# EAGLE design vogelschuss-2 (EAGLE 4.15)
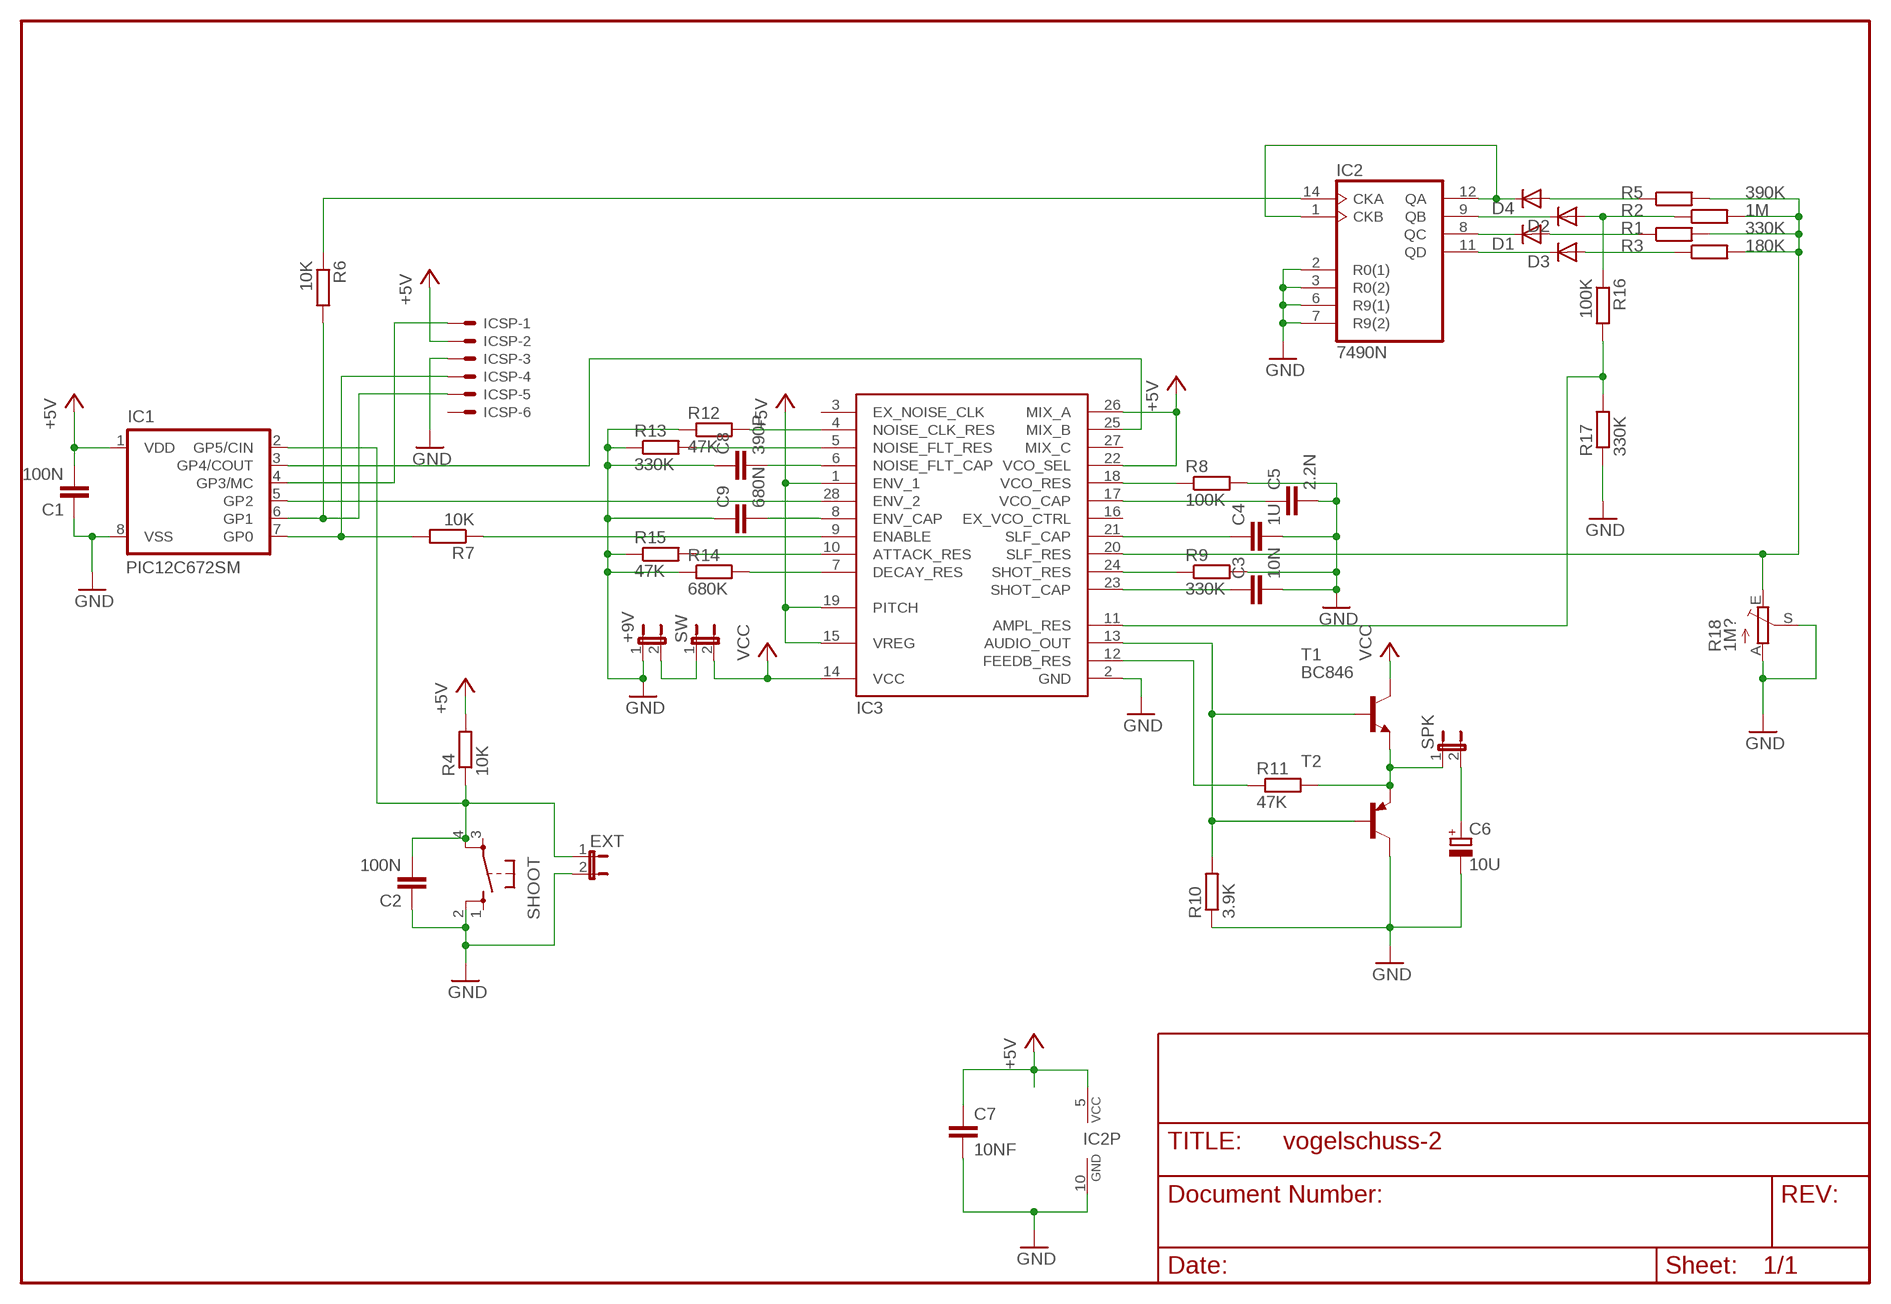
[diagram p0: schematic, sheet 1]

## Parts
+9V  JP1E  [JP1]
C1  100N  C-EUC0805  [C0805]
C2  100N  C-EUC0805  [C0805]
C3  10N  C-EUC0805  [C0805]
C4  1U  C-EUC0805  [C0805]
C5  2.2N  C-EUC0805  [C0805]
C6  10U  CPOL-EUE2,5-6E  [E2,5-6E]
C7  10NF  C-EUC0805  [C0805]
C8  390P  C-EUC0805  [C0805]
C9  680N  C-EUC0805  [C0805]
D1  DIODE-0805  [0805]
D2  DIODE-0805  [0805]
D3  DIODE-0805  [0805]
D4  DIODE-0805  [0805]
EXT  JP1E  [JP1]
IC1  PIC12C672SM  [SO-08M]
IC2  7490N  [DIL14]
IC3  SN76477  [DIL28-6]
ICSP  53047-06  [53047-06]
R1  330K  R-EU_M0805  [M0805]
R2  1M  R-EU_M0805  [M0805]
R3  180K  R-EU_M0805  [M0805]
R4  10K  R-EU_M0805  [M0805]
R5  390K  R-EU_M0805  [M0805]
R6  10K  R-EU_M0805  [M0805]
R7  10K  R-EU_M0805  [M0805]
R8  100K  R-EU_M0805  [M0805]
R9  330K  R-EU_M0805  [M0805]
R10  3.9K  R-EU_M0805  [M0805]
R11  47K  R-EU_M0805  [M0805]
R12  47K  R-EU_R0805  [R0805]
R13  330K  R-EU_M0805  [M0805]
R14  680K  R-EU_M0805  [M0805]
R15  47K  R-EU_R0805  [R0805]
R16  100K  R-EU_M0805  [M0805]
R17  330K  R-EU_M0805  [M0805]
R18  1M?  TRIM_EU-CA6V  [CA6V]
SHOOT  10XX  [B3F-10XX]
SPK  JP1E  [JP1]
SW  JP1E  [JP1]
T1  BC846  [SOT23]
T2  BC856A-PNP-SOT23-BEC  [SOT23-BEC]

## Nets
+5V: C1.2 C7.1 IC1.1(VDD) IC2.5(VCC) IC3.1(ENV_1) IC3.15(VREG) IC3.19(PITCH) IC3.22(VCO_SEL) IC3.26(MIX_A) ICSP.2 R4.2
GND: +9V.1 C1.1 C2.1 C3.2 C4.2 C5.2 C6.- C7.2 C8.1 C9.1 EXT.2 IC1.8(VSS) IC2.2(R0(1)) IC2.3(R0(2)) IC2.6(R9(1)) IC2.7(R9(2)) IC2.10(GND) IC3.2(GND) ICSP.3 R8.2 R9.2 R10.1 R12.1 R13.1 R14.1 R15.1 R17.1 R18.A R18.S SHOOT.2 T2.C
N$1: C6.+ SPK.2
N$2: C2.2 EXT.1 IC1.2(GP5/CIN) R4.1 SHOOT.4
N$3: IC1.6(GP1) ICSP.5 R6.2
N$4: IC2.14(CKA) R6.1
N$5: D4.2(C) IC2.1(CKB) IC2.12(QA)
N$6: D2.2(C) IC2.9(QB)
N$7: D1.2(C) IC2.8(QC)
N$8: D3.2(C) IC2.11(QD)
N$9: D2.1(A) R2.1 R16.1
N$10: D4.1(A) R5.1
N$11: D1.1(A) R1.1
N$12: D3.1(A) R3.1
N$13: IC3.20(SLF_RES) R1.2 R2.2 R3.2 R5.2 R18.E
N$14: IC3.4(NOISE_CLK_RES) R12.2
N$15: R11.2 SPK.1 T1.2(E) T2.E
N$16: IC3.18(VCO_RES) R8.1
N$17: IC3.13(AUDIO_OUT) R10.2 T1.1(B) T2.B
N$18: IC3.12(FEEDB_RES) R11.1
N$19: IC3.11(AMPL_RES) R16.2 R17.2
N$20: C5.1 IC3.17(VCO_CAP)
N$21: C4.1 IC3.21(SLF_CAP)
N$22: IC3.5(NOISE_FLT_RES) R13.2
N$23: IC3.24(SHOT_RES) R9.1
N$24: C3.1 IC3.23(SHOT_CAP)
N$25: IC3.10(ATTACK_RES) R15.2
N$26: IC3.7(DECAY_RES) R14.2
N$27: IC1.7(GP0) ICSP.4 R7.2
N$28: C8.2 IC3.6(NOISE_FLT_CAP)
N$29: C9.2 IC3.8(ENV_CAP)
N$30: IC1.3(GP4/COUT) IC3.25(MIX_B)
N$31: IC1.5(GP2) IC3.28(ENV_2)
N$32: IC3.9(ENABLE) R7.1
N$33: IC1.4(GP3/MC) ICSP.1
N$34: +9V.2 SW.1
VCC: IC3.14(VCC) SW.2 T1.3(C)
Unconnected: IC3.3(EX_NOISE_CLK) IC3.16(EX_VCO_CTRL) IC3.27(MIX_C) ICSP.6 SHOOT.1 SHOOT.3

## Library data of the parts
+9V EXT SPK SW = jumper:JP1E: JUMPER
C1-C5 C7-C9 = rcl:C-EU: CAPACITOR, European symbol
C6 = rcl:CPOL-EU: POLARIZED CAPACITOR, European symbol
D1-D4 = diode:DIODE-: DIODE
IC1 = microchip:PIC12C*?: MICROCONTROLLER
IC2 = 74xx-eu:74*90: Decade, divide by twelve and binary COUNTER
IC3 = turbod3:SN76477
ICSP = con-molex:53?-06: CONNECTOR wire to board 1.25 mm (.049 inch) pitch header
R1-R17 = rcl:R-EU_: RESISTOR, European symbol
R18 = pot:TRIM_EU-: POTENTIOMETER
SHOOT = KEY_B:10XX
T1 = transistor:BC846: NPN TRANSISTOR
T2 = transistor:*-PNP-: PNP Transistror

## Net classes
0 default: width 0.3 mm

## Board
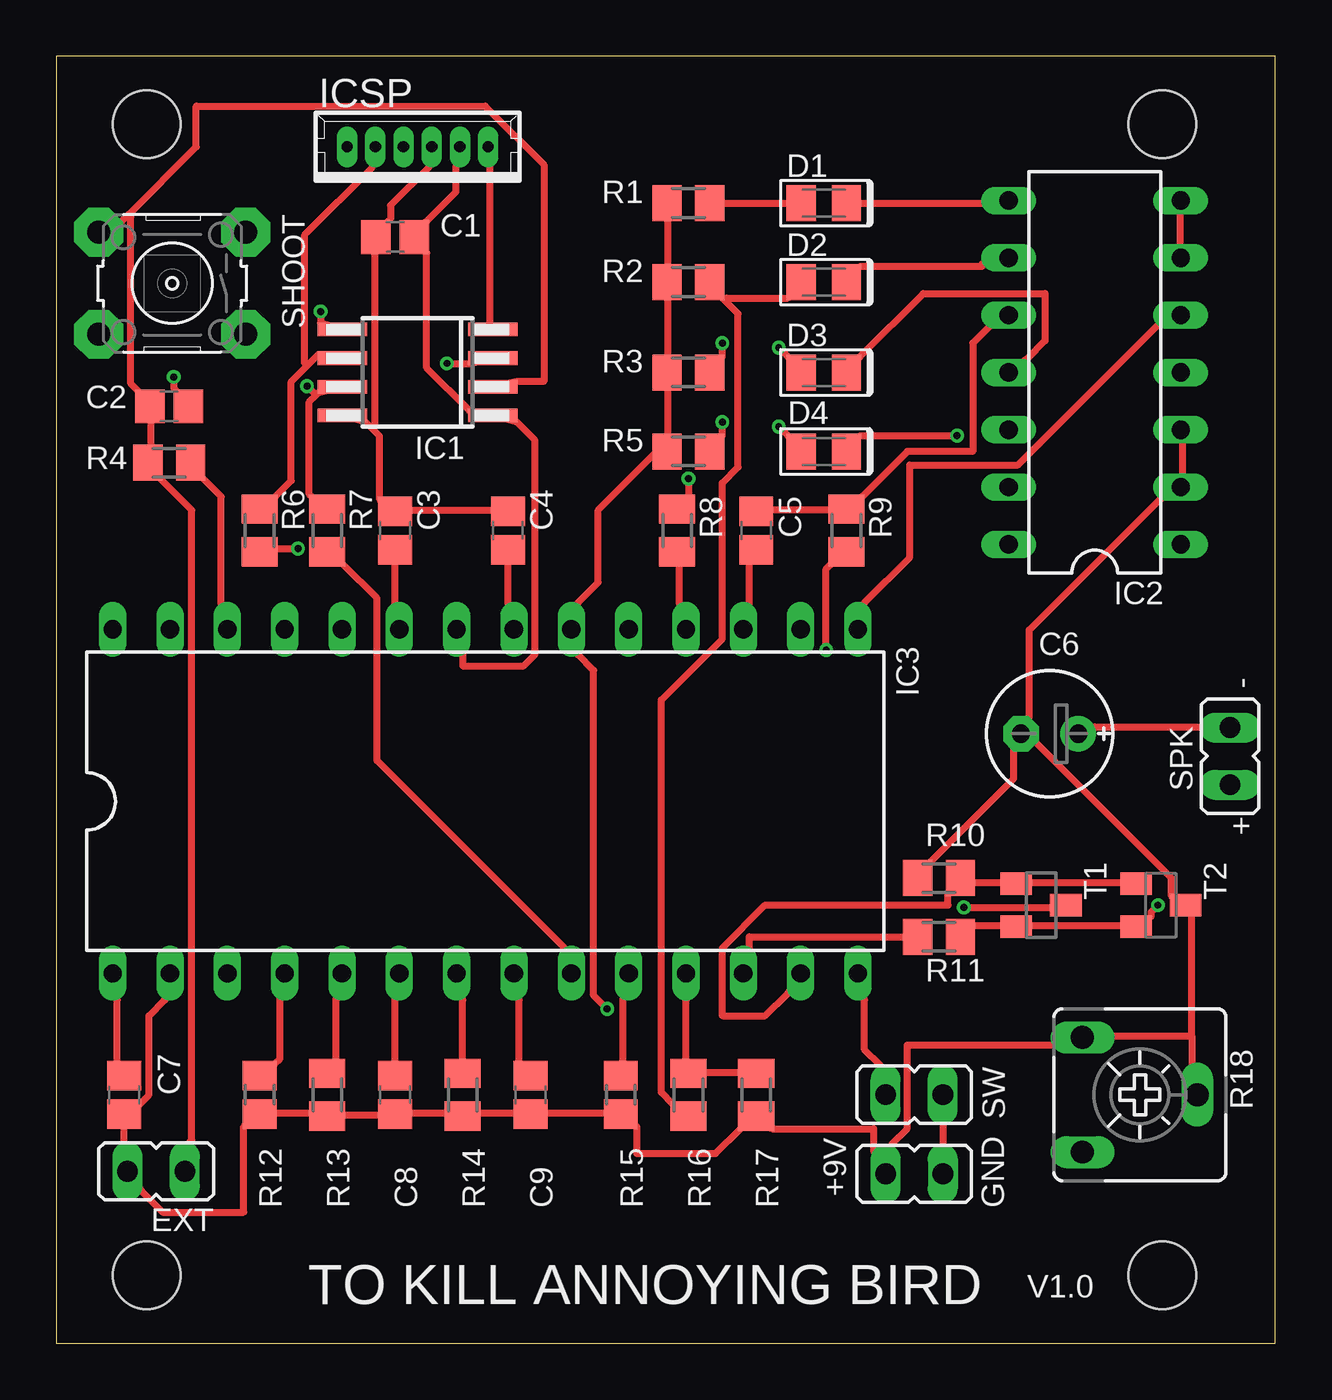
[diagram p1: board, top side]
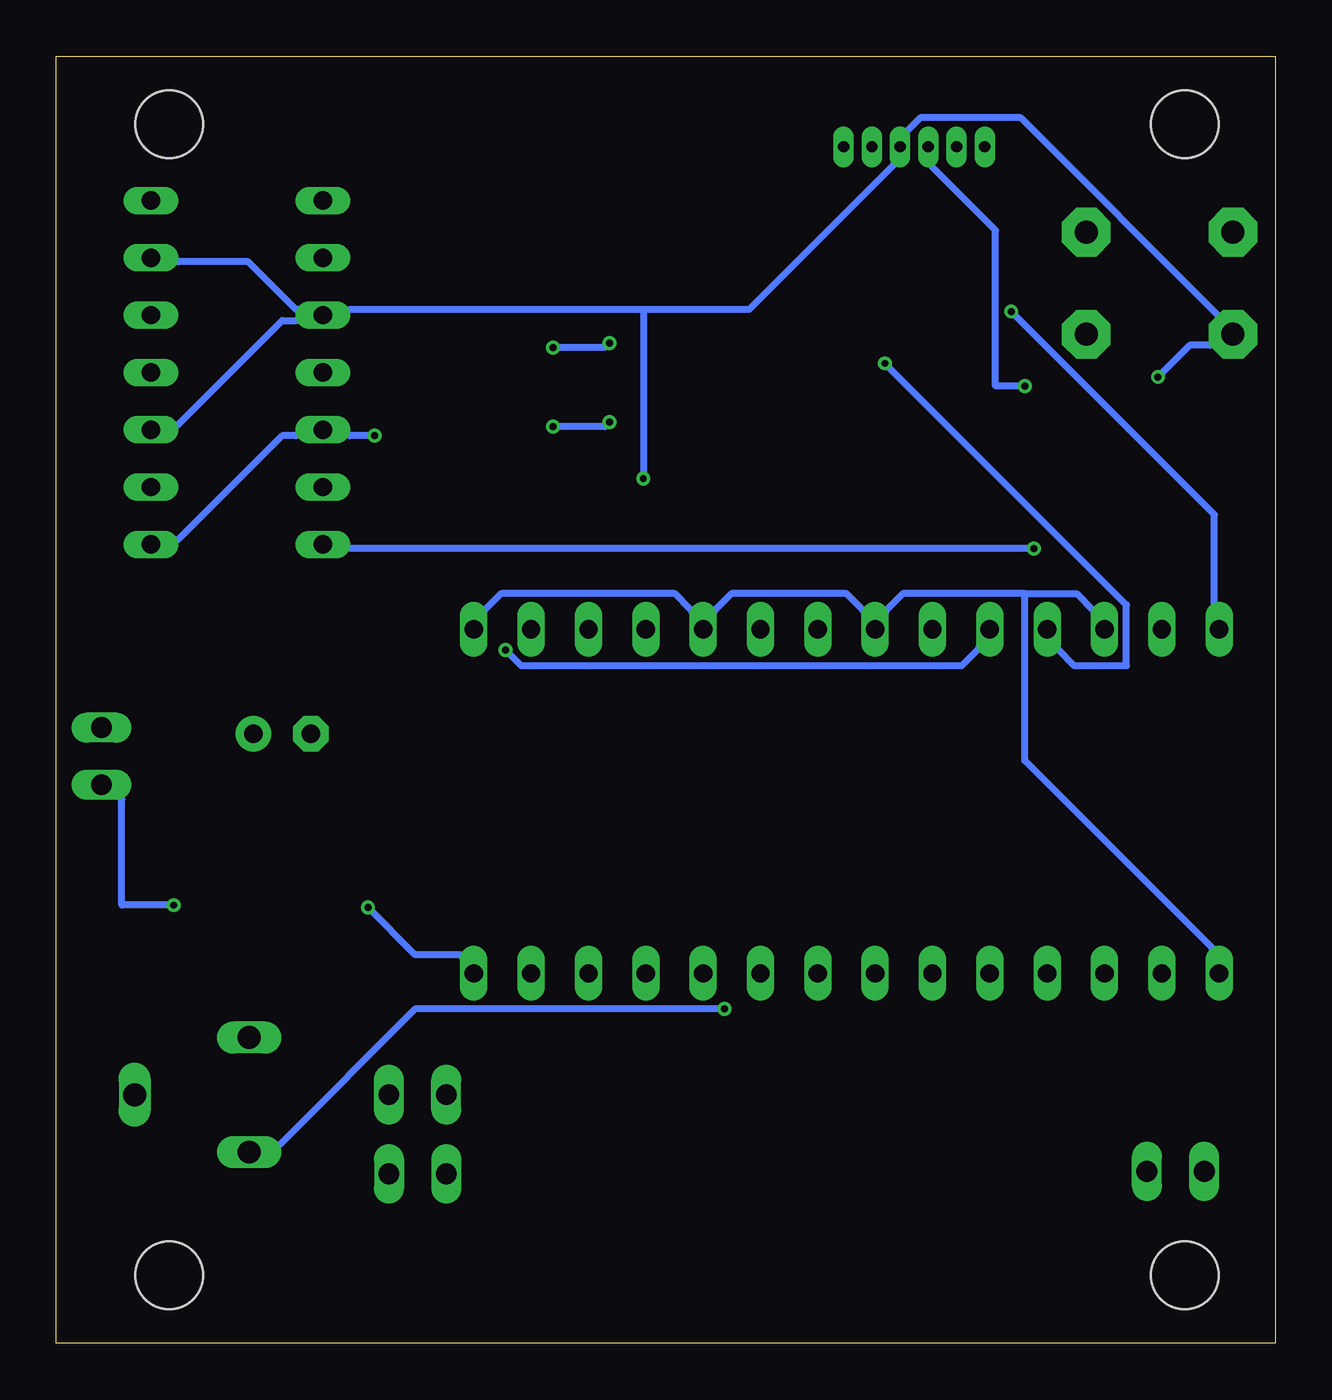
[diagram p2: board, bottom side, seen from below]

Size 54 x 57 mm. Coordinates in mm from the lower left corner, seen from the top.
Outline: 0,0 54,0 54,57 0,57 0,0
Copper layers (1*16): Top 0.035mm / dielectric 1.5mm / Bottom 0.035mm
Design rules "PCB-POOL": minimum track width 6mil, minimum drill 12mil, track to track 6mil, track to pad 6mil, pad to pad 6mil, via to via 6mil, smd to smd 6mil, copper to edge 20mil, drill to drill 8mil, minimum pad ring 8mil, minimum via ring 6mil, stop-mask expansion 3mil, vias tented up to drill 0mil, thermal gap 8mil
Holes 3 mm at 4,54 49,54 4,3 49,3

### Footprints (pad centres in the part's own frame; a part is rotated, then mirrored left to right if it is on the bottom)
JP1 = drill 0.914 long: 1 0,-1.27; 2 0,1.27
C0805 = smd 1.3 x 1.5: 1 -0.85,0; 2 0.85,0
E2,5-6E = drill 0.813 pad 1.575 round: + -1.27,0 | drill 0.813 pad 1.575 octagon: - 1.27,0
0805 = smd 1.3 x 1.6: 1 -1,0; 2 1,0
SO-08M = smd 0.6 x 2.2: 1 -1.905,-3.33; 2 -0.635,-3.33; 3 0.635,-3.33; 4 1.905,-3.33; 5 1.905,3.33; 6 0.635,3.33; 7 -0.635,3.33; 8 -1.905,3.33
DIL14 = drill 0.813 long: 1 -7.62,-3.81; 2 -5.08,-3.81; 3 -2.54,-3.81; 4 0,-3.81; 5 2.54,-3.81; 6 5.08,-3.81; 7 7.62,-3.81; 8 7.62,3.81; 9 5.08,3.81; 10 2.54,3.81; 11 0,3.81; 12 -2.54,3.81; 13 -5.08,3.81; 14 -7.62,3.81
DIL28-6 = drill 0.813 long: 1 -16.51,-7.62; 2 -13.97,-7.62; 3 -11.43,-7.62; 4 -8.89,-7.62; 5 -6.35,-7.62; 6 -3.81,-7.62; 7 -1.27,-7.62; 8 1.27,-7.62; 9 3.81,-7.62; 10 6.35,-7.62; 11 8.89,-7.62; 12 11.43,-7.62; 13 13.97,-7.62; 14 16.51,-7.62; 15 16.51,7.62; 16 13.97,7.62; 17 11.43,7.62; 18 8.89,7.62; 19 6.35,7.62; 20 3.81,7.62; 21 1.27,7.62; 22 -1.27,7.62; 23 -3.81,7.62; 24 -6.35,7.62; 25 -8.89,7.62; 26 -11.43,7.62; 27 -13.97,7.62; 28 -16.51,7.62
53047-06 = drill 0.5 pad 0.698 long: 1 3.125,0; 2 1.875,0; 3 0.625,0; 4 -0.625,0; 5 -1.875,0; 6 -3.125,0
M0805 = smd 1.3 x 1.6: 1 -0.95,0; 2 0.95,0
R0805 = smd 1.3 x 1.5: 1 -0.85,0; 2 0.85,0
CA6V = drill 1.016 long: A -2.54,-2.54; E 2.54,-2.54; S 0,2.54
B3F-10XX = drill 1.016 pad 2.159 octagon: 1 -3.379,2.312; 2 3.123,2.312; 3 -3.379,-2.209; 4 3.123,-2.209
SOT23 = smd 1 x 1.4: 1 -0.95,-1.1; 2 0.95,-1.1; 3 0,1.1
SOT23-BEC = smd 1 x 1.4: B -0.95,-1.1; C 0,1.1; E 0.95,-1.1

### Placement (x,y rotation side)
+9V  38,7.5 270 top
C1  15,49 0 top
C2  5,41.5 180 top
C3  15,36 90 top
C4  20,36 90 top
C5  31,36 90 top
C6  44,27 180 top
C7  3,11 270 top
C8  15,11 90 top
C9  21,11 90 top
D1  34,50.5 0 top
D2  34,47 0 top
D3  34,43 0 top
D4  34,39.5 0 top
EXT  4.42,7.61 90 top
IC1  16,43 90 top
IC2  46,43 90 top
IC3  19,24 0 top
ICSP  16,53 0 top
R1  28,50.5 180 top
R2  28,47 180 top
R3  28,43 180 top
R4  5,39 0 top
R5  28,39.5 180 top
R6  9,36 90 top
R7  12,36 90 top
R8  27.5,36 90 top
R9  35,36 90 top
R10  39.1,20.6 0 top
R11  39.1,18 0 top
R12  9,11 90 top
R13  12,11 90 top
R14  18,11 90 top
R15  25,11 90 top
R16  28,11 90 top
R17  31,11 90 top
R18  48,11 270 top
SHOOT  5,47 180 top
SPK  52,26 0 top
SW  38,11 90 top
T1  43.62,19.4 270 top
T2  48.93,19.4 270 top

### Tracks (layer width: path | path; a pad name or v marks a point on that pad's centre or on a via)
+5V
  Top 0.3: C7.1 2.7,12.4 2.7,15.2 IC3.1 | R4.2 6.5,38.3 7.3,37.5 7.3,32.8 IC3.26 | ICSP.2 17.7,52.1 17.7,51 16.4,49.7 C1.2 16.4,48.3 16.4,43.2 18.3,41.3 IC1.1 20.4,40.8 21.2,40 21.2,30.5 20.7,30 18,30 18,30.5 IC3.22 | IC2.5 48.8,45.1 42.6,38.9 37.8,38.9 37.8,34.8 35.8,32.8 IC3.15
  Bottom 0.3: 11.1,33.2 11.1,25.8 2.8,17.5 IC3.1 | 11.1,33.2 8.8,33.2 8.1,32.5 IC3.26 | IC3.15 35,32.5 34.3,33.2 26.6,33.2 25.9,32.5 IC3.19 24.8,32.5 24.1,33.2 19,33.2 18.3,32.5 IC3.22 17.2,32.5 16.5,33.2 11.1,33.2
GND  (via drill 0.3)
  Top 0.3: v5.2,42.8 5.2,42.3 5.3,42.2 C2.1 | ICSP.3 16.5,52.1 14.8,50.4 14.8,49.8 14.7,49.7 C1.1 14.1,48.3 14.1,40.6 14,40.5 | C4.2 19.3,36.9 15.7,36.9 C3.2 14.3,37.4 14.3,40.2 14,40.5 | 14,40.5 13.7,40.8 IC1.8 | IC2.3 49.9,39.9 49.9,38.5 IC2.2 48.9,37.4 43.1,31.6 43.1,27.7 C6.- | C5.2 31.7,36.9 34.3,36.9 R9.2 35.7,37.5 37.7,39.5 40.6,39.5 40.6,44.3 41.3,45 IC2.10 | IC2.7 49.8,50.1 49.8,48.6 IC2.6 | R10.1 38.7,21.3 42.4,25 42.4,26.3 C6.- | 50.3,13.6 50.3,12.4 R18.S | 50.3,13.6 50.3,19 T2.C 49.4,19.8 49.4,20.6 43.4,26.6 C6.- | 50.3,13.6 46.8,13.6 R18.A 44.1,13.2 37.7,13.2 37.7,9.5 37,8.8 +9V.1 36.2,8.5 36.2,9.5 31.7,9.5 R17.1 30.3,9.5 29.2,8.4 25.7,8.4 25.7,9.6 R15.1 24.3,10.2 21.7,10.2 C9.1 20.3,10.2 18.7,10.2 R14.1 17.3,10.2 15.7,10.2 C8.1 14.3,10.1 12.7,10.1 R13.1 11.3,10.2 9.7,10.2 R12.1 8.3,9.6 8.3,5.8 4.7,5.8 3.8,6.7 EXT.2 3,8.9 C7.2 3.7,10.6 4.1,11 4.1,14.5 4.8,15.2 IC3.2 | v28,38.3 28,37.5 R8.2
  Bottom 0.3: v5.2,42.8 3.8,44.2 2.9,44.2 SHOOT.2 2.5,45.5 11.3,54.3 15.7,54.3 16.3,53.7 ICSP.3 16.9,52.2 23.3,45.8 28,45.8 | IC2.10 43.4,45.8 45.5,47.9 48.6,47.9 IC2.6 | IC2.3 48.6,40.7 44,45.3 43.4,45.3 IC2.10 | 28,45.8 41,45.8 IC2.10 | 28,45.8 v28,38.3
N$1
  Top 0.3: SPK.2 50.7,27.3 46,27.3 C6.+
N$2
  Top 0.3: 3.2,50 2.9,49.7 SHOOT.4 | 3.2,50 6.2,53 6.2,54.8 19,54.8 21.6,52.2 21.6,42.6 20.4,42.6 IC1.2 | 3.2,50 3.3,49.9 3.3,42.5 3.6,42.2 C2.2 4.2,40.8 4.2,39.7 R4.1 4.6,38.3 6,36.9 6,9 5.9,8.9 EXT.1
N$3
  Top 0.3: 11.1,43.3 11.6,43.8 IC1.6 | 11.1,43.3 10.4,42.6 10.4,38.2 9.7,37.5 R6.2 | ICSP.5 14,52.1 11,49.1 11,43.4 11.1,43.3
N$4  (via drill 0.3)
  Top 0.3: v10.7,35.2 9.7,35.2 R6.1
  Bottom 0.3: v10.7,35.2 41,35.2 IC2.14
N$5  (via drill 0.3)
  Top 0.3: v39.9,40.2 35.6,40.2 D4.2
  Bottom 0.3: v39.9,40.2 41,40.2 IC2.12 43.4,40.2 44,40.2 48.6,35.6 IC2.1
N$6
  Top 0.3: D2.2 35.6,47.7 41,47.7 41,47.8 IC2.9
N$7
  Top 0.3: D1.2 41,50.5 IC2.8
N$8
  Top 0.3: D3.2 35.6,43.7 38.4,46.5 43.8,46.5 43.8,44.4 43,43.6 IC2.11
N$9
  Top 0.3: 29.6,46.2 29.5,46.3 R2.1 | 29.6,46.2 30.2,45.6 30.2,38.8 29.5,38.1 29.5,31.2 26.8,28.5 26.8,11.1 27.3,10.6 R16.1 | D2.1 32.4,46.3 29.7,46.3 29.6,46.2
N$10  (via drill 0.3)
  Top 0.3: v29.5,40.8 29.5,40.2 R5.1 | v32,40.6 32.4,40.2 D4.1
  Bottom 0.3: v29.5,40.8 29.7,40.6 v32,40.6
N$11
  Top 0.3: R1.1 D1.1
N$12  (via drill 0.3)
  Top 0.3: v29.5,44.3 29.5,43.7 R3.1 | v32,44.1 32.4,43.7 D3.1
  Bottom 0.3: v29.5,44.3 29.7,44.1 v32,44.1
N$13  (via drill 0.3)
  Top 0.3: R1.2 27.1,49.8 27.1,47.7 R2.2 27.1,46.3 27.1,43.7 R3.2 27.1,42.3 27.1,40.2 R5.2 26.5,39.4 24,36.9 24,33.7 23.1,32.8 IC3.20 23.1,30.5 23.8,29.8 23.8,15.4 v24.4,14.8
  Bottom 0.3: v24.4,14.8 38.1,14.8 44.1,8.8 R18.E
N$14
  Top 0.3: R12.2 9.7,12.4 9.9,12.6 9.9,15.2 IC3.4
N$15  (via drill 0.3)
  Top 0.3: R11.2 40.6,18.5 41.9,18.5 T1.2 43.2,18.5 47.2,18.5 T2.E 48.5,18.9 48.5,19.1 v48.8,19.4
  Bottom 0.3: v48.8,19.4 51.1,19.4 51.1,24.1 SPK.1
N$16
  Top 0.3: R8.1 27.6,34.5 27.6,32.8 IC3.18
N$17
  Top 0.3: T2.B 47.2,20.4 43.2,20.4 T1.1 41.9,20.4 40.6,20.4 R10.2 39.5,19.9 39.5,19.4 31.4,19.4 29.5,17.5 29.5,14.5 31.4,14.5 32.4,15.5 IC3.13
N$18
  Top 0.3: R11.1 30.7,18 30.7,17.5 IC3.12
N$19
  Top 0.3: R17.2 30.3,12 28.7,12 R16.2 27.9,12.5 27.9,15.2 IC3.11
N$20
  Top 0.3: C5.1 30.7,34.6 30.7,32.8 IC3.17
N$21
  Top 0.3: C4.1 20,32.8 IC3.21
N$22
  Top 0.3: R13.2 12.4,12.5 12.4,15.2 IC3.5
N$23  (via drill 0.3)
  Top 0.3: v34.1,30.7 34.1,34.3 34.3,34.5 R9.1
  Bottom 0.3: v34.1,30.7 33.4,30 13.9,30 13.2,30.7 IC3.24
N$24
  Top 0.3: C3.1 15,32.8 IC3.23
N$25
  Top 0.3: R15.2 25.1,12.4 25.1,15.2 IC3.10
N$26
  Top 0.3: R14.2 18,15.2 IC3.7
N$27  (via drill 0.3)
  Top 0.3: 11.5,42 11.6,42.1 IC1.7 | 11.5,42 11.2,41.7 11.2,37.6 11.3,37.5 R7.2 | 11.5,42 v11.1,42.4
  Bottom 0.3: v11.1,42.4 12.4,42.4 12.4,49.3 15.2,52.1 ICSP.4
N$28
  Top 0.3: C8.2 15,15.2 IC3.6
N$29
  Top 0.3: C9.2 20.5,12.4 20.5,15.2 IC3.8
N$30  (via drill 0.3)
  Top 0.3: v17.3,43.4 18.3,43.4 IC1.3
  Bottom 0.3: v17.3,43.4 6.6,32.7 6.6,30 8.9,30 9.6,30.7 IC3.25
N$31  (via drill 0.3)
  Top 0.3: v11.7,45.7 11.7,45.2 IC1.5
  Bottom 0.3: v11.7,45.7 2.7,36.7 2.7,32.8 IC3.28
N$32
  Top 0.3: R7.1 12.7,34.5 14.2,33 14.2,25.8 22.5,17.5 IC3.9
N$33
  Top 0.3: ICSP.1 19.2,52.1 19.2,45.2 IC1.4
N$34
  Top 0.3: +9V.2 39.3,8.8 39.3,9.7 SW.1
VCC  (via drill 0.3)
  Top 0.3: v40.2,19.3 44.1,19.3 T1.3 | SW.2 36.5,12.3 35.8,13 35.8,15.2 IC3.14
  Bottom 0.3: v40.2,19.3 38.1,17.2 36.1,17.2 IC3.14

### Text on the board
tNames: - | + | GND | TO KILL ANNOYING BIRD | V1.0